# EasyEDA Pro project Class D amp.eprj, schematic DSP Adapter
Board Name: DSP Adapter; Create Date: 2026-05-17; Page Name: P1; Project Name: Class D amp; Schematic Name: DSP Adapter; Update Date: 2026-05-29; Company: EasyEDA.com; Page Size: A4; Version: V1.0
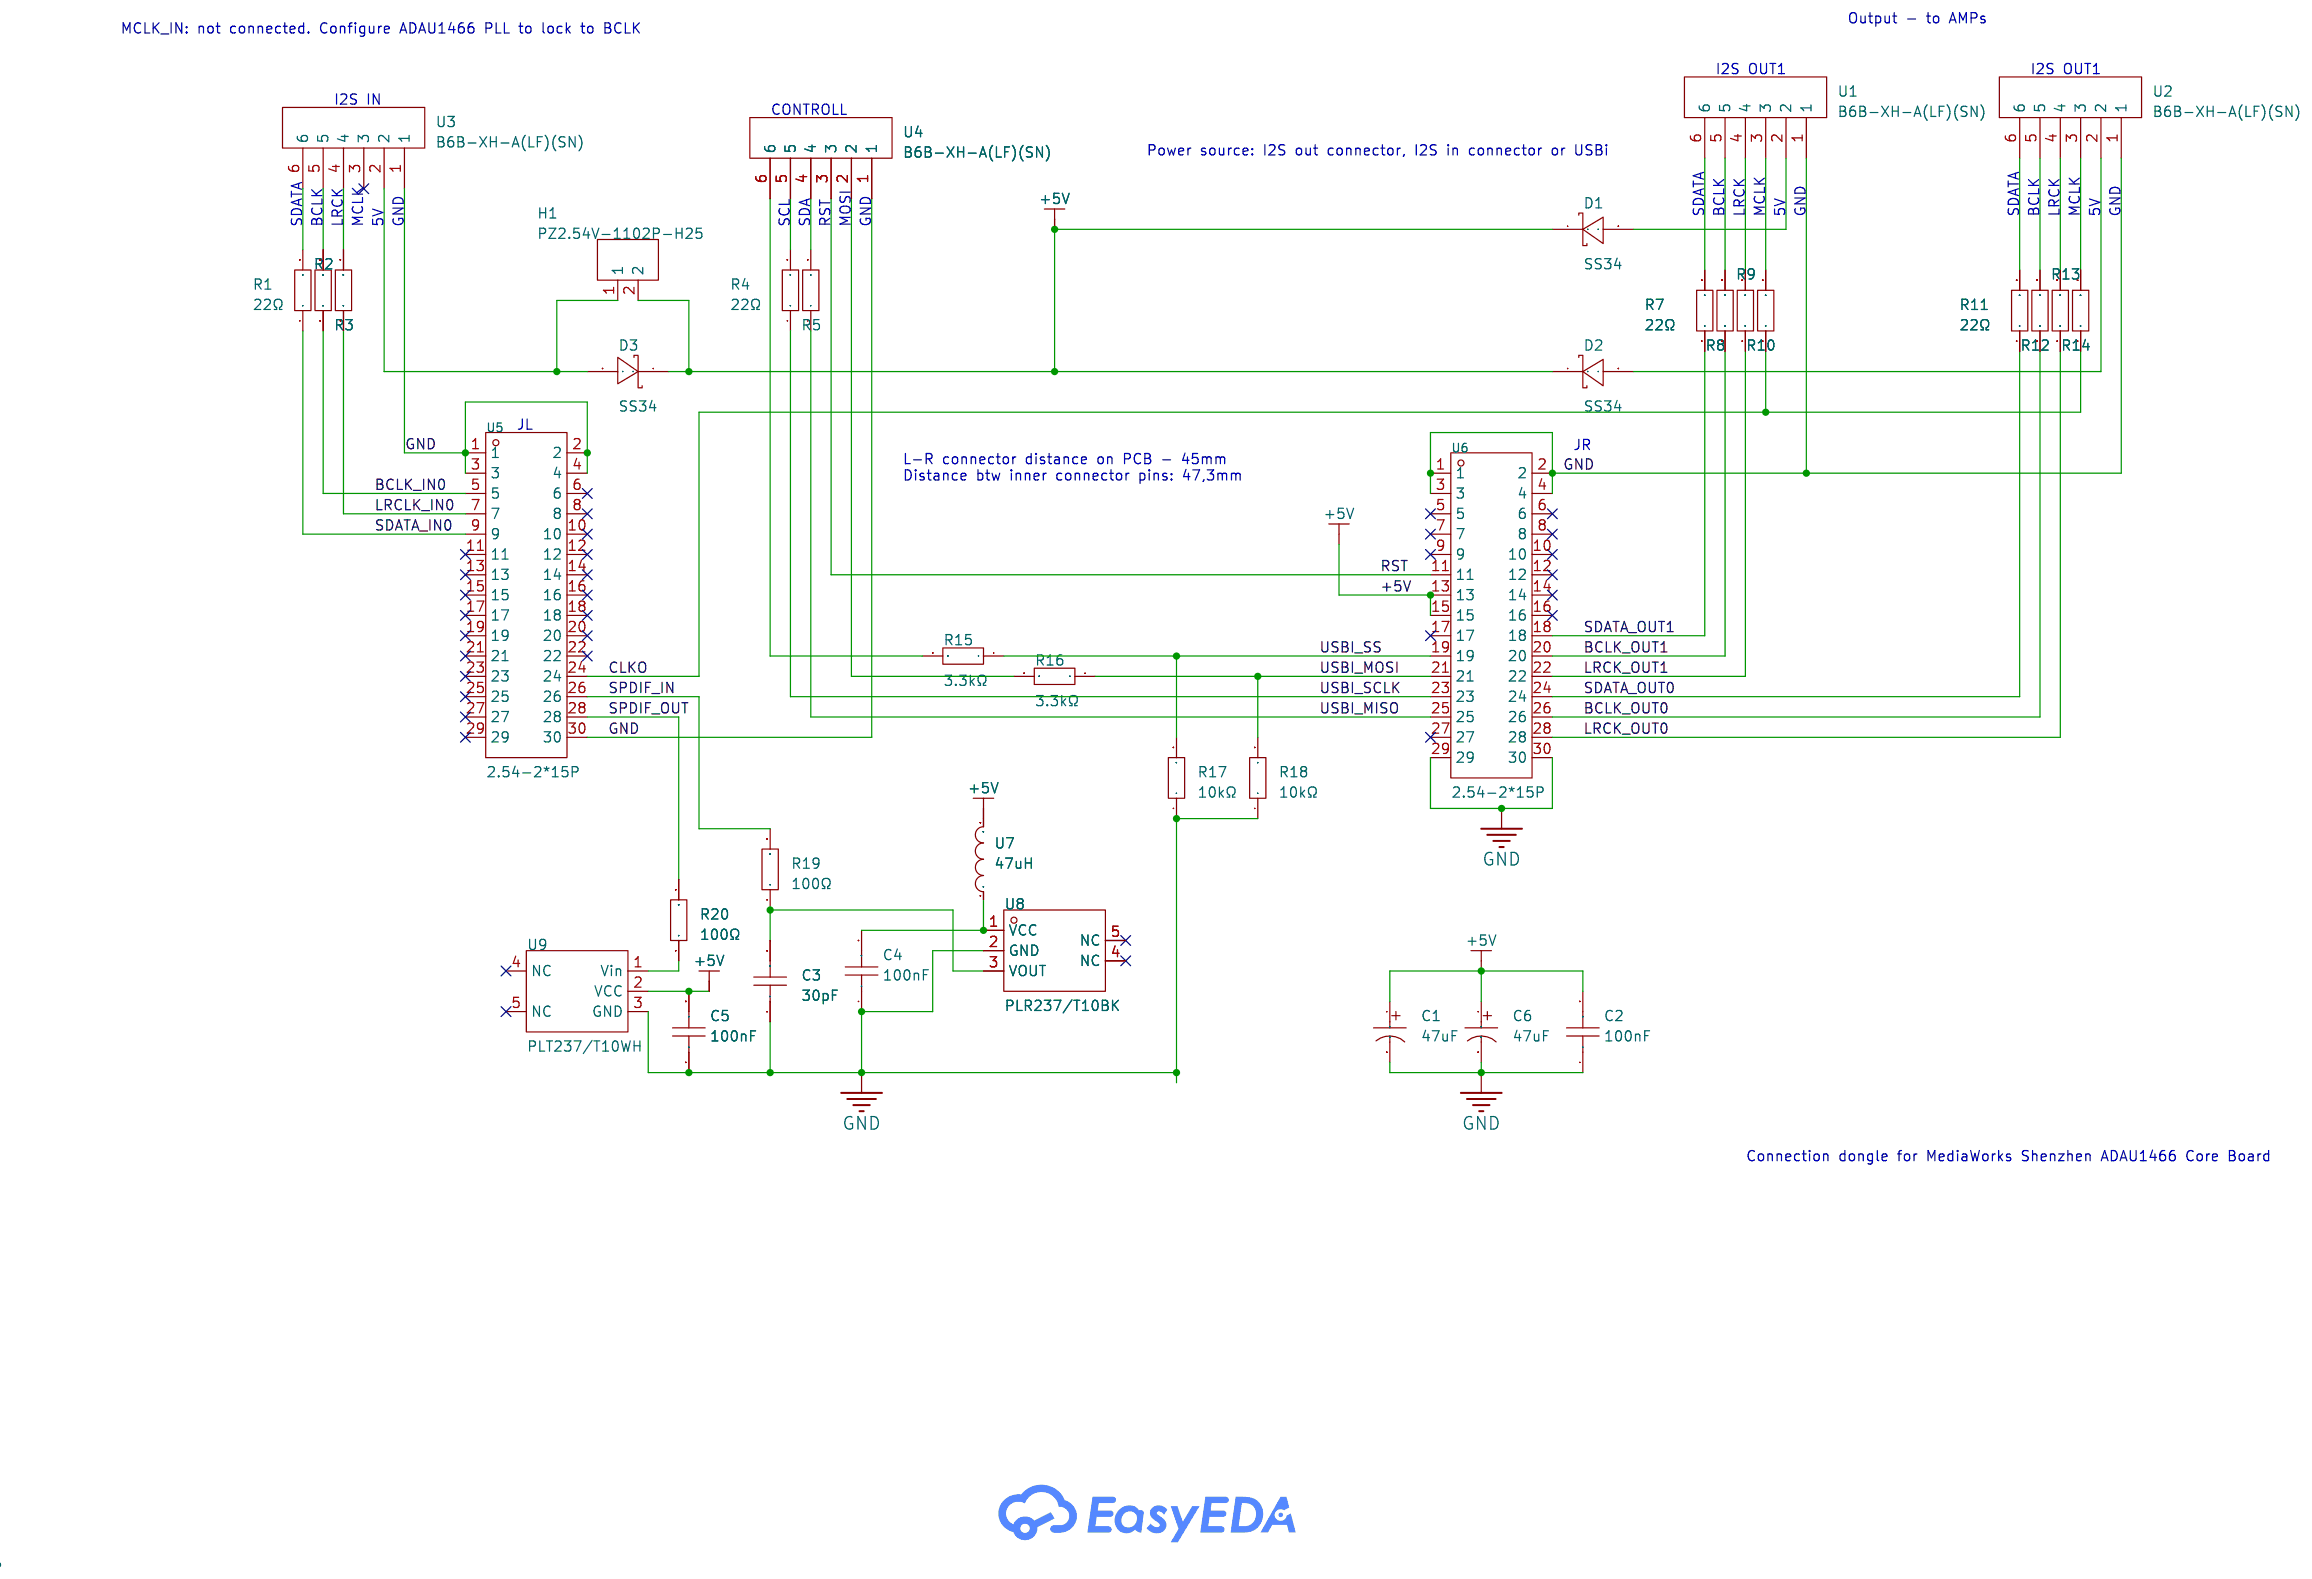
[diagram p5: schematic sheet]

## Parts
C1  47uF  [CAP-SMD_BD6.3-L6.6-W6.6-RD]
C2  100nF  [C0402]
C3  30pF  [C0805]
C4  100nF  [C0402]
C5  100nF  [C0402]
C6  47uF  [CAP-SMD_BD6.3-L6.6-W6.6-RD]
D1  SS34  [SMA_L4.3-W2.6-LS5.2-RD]
D2  SS34  [SMA_L4.3-W2.6-LS5.2-RD]
D3  SS34  [SMA_L4.3-W2.6-LS5.2-RD]
H1  PZ2.54V-1102P-H25  [HDR-TH_2P-P2.54-V-M-2]
R1  22Ω  [R0402]
R2  22Ω  [R0402]
R3  22Ω  [R0402]
R4  22Ω  [R0402]
R5  22Ω  [R0402]
R7  22Ω  [R0402]
R8  22Ω  [R0402]
R9  22Ω  [R0402]
R10  22Ω  [R0402]
R11  22Ω  [R0402]
R12  22Ω  [R0402]
R13  22Ω  [R0402]
R14  22Ω  [R0402]
R15  3.3kΩ  [R0402]
R16  3.3kΩ  [R0402]
R17  10kΩ  [R0603]
R18  10kΩ  [R0603]
R19  100Ω  [R0402]
R20  100Ω  [R0402]
U1  B6B-XH-A(LF)(SN)  [CONN-TH_6P-P2.50_B6B-XH-A-LF-SN]
U2  B6B-XH-A(LF)(SN)  [CONN-TH_6P-P2.50_B6B-XH-A-LF-SN]
U3  B6B-XH-A(LF)(SN)  [CONN-TH_6P-P2.50_B6B-XH-A-LF-SN]
U4  B6B-XH-A(LF)(SN)  [CONN-TH_6P-P2.50_B6B-XH-A-LF-SN]
U5  2.54-2*15P  [HDR-TH_30P-P2.54-V-F-R2-C15-S2.54]
U6  2.54-2*15P  [HDR-TH_30P-P2.54-V-F-R2-C15-S2.54]
U7  47uH  [IND-SMD_L4.5-W4.0]
U8  PLR237/T10BK  [OPTO-TH_PLR237-T10BK]
U9  PLT237/T10WH  [CONN-TH_PLT237-T10WH]

## Library data of the parts
C1 C6 = VES470M1HTR-0607: LCSC Part Name: 47uF ±20% 50V; Supplier Part: C108053; Manufacturer: Lelon(立隆); Supplier Footprint: SMD,D6.3xL7.7mm; JLCPCB Part Class: Extended Part; Datasheet: https://item.szlcsc.com/datasheet/VES470M1HTR-0607/109272.html; Supplier: LCSC; Tolerance: ±20%; Voltage Rating: 50V; Diameter: 6.3mm; Height - Seated (Max): 7.7mm; Lifetime: 1000hrs@105℃; Operating Temperature: -45℃~+105℃
C2 C4 C5 = CL05B104KO5NNNC: Capacitance:100nF Tolerance:±10% Tolerance:±10% Voltage Rating:16V Temperature Coefficient:X7R; LCSC Part Name: 100nF ±10% 16V; Supplier Part: C1525; Manufacturer: SAMSUNG(三星); Supplier Footprint: 0402; JLCPCB Part Class: Basic Part; Datasheet: https://item.szlcsc.com/datasheet/CL05B104KO5NNNC/1877.html; Supplier: LCSC; Tolerance: ±10%; Voltage Rating: 16V; Temperature Coefficient: X7R
C3 = HGC0805G0300J500NTGJ: LCSC Part Name: 30pF ±5% 50V; Supplier Part: C5186744; Manufacturer: Chinocera(华瓷); Supplier Footprint: 0805; JLCPCB Part Class: Extended Part; Datasheet: https://item.szlcsc.com/datasheet/HGC0805G0300J500NTGJ/5857753.html; Supplier: LCSC; Tolerance: ±5%; Voltage Rating: 50V; Temperature Coefficient: C0G
D1-D3 = SS34_C8678: LCSC Part Name: 电压:40V 电流:3A; Supplier Part: C8678; Manufacturer: MDD(辰达半导体); Supplier Footprint: SMA(DO-214AC); JLCPCB Part Class: Basic Part; Datasheet: https://item.szlcsc.com/datasheet/SS34/9178.html; Supplier: LCSC; Diode Configuration: Independent; Voltage - Forward(Vf@If): 550mV@3A; Voltage - DC Reverse(Vr): 40V; Current - Rectified: 3A; Reverse Leakage Current (Ir): 500uA@40V; Operating Junction Temperature Range: -55℃~+125℃
H1 = PZ2.54V-1102P-H25: LCSC Part Name: 1x2P 间距:2.54mm 方针 直插; Supplier Part: C42431681; Manufacturer: JXTCONN(聚兴泰); Supplier Footprint: 插件,P=2.54mm; JLCPCB Part Class: Extended Part; Datasheet: https://item.szlcsc.com/datasheet/PZ2.54V-1102P-H25/44458911.html; Supplier: LCSC; Pin Structure: 1x2P; Pitch: 2.54mm; Circluar Pins/Square Pins: Pin Header; Mounting Type: Through Hole; Number of Rows: 1; Number of Pins: 2P; Current Rating: 3A; Length of Mating Pin: 6mm; Insulation Height: 2.5mm; Length of End Connection Pin: 3mm; Contact Material: Brass; Contact Plating: Gold; Operating Temperature: -40℃~+105℃; Color: Black
R1-R5 R7-R14 = RC0402FR-0722RL: LCSC Part Name: 厚膜电阻 22Ω ±1% 62.5mW; Supplier Part: C114765; Manufacturer: YAGEO(国巨); Supplier Footprint: 0402; JLCPCB Part Class: Extended Part; Datasheet: https://atta.szlcsc.com/upload/public/pdf/source/20180821/C275644_0D56F95EFF785E7D9A1FEF436B37DA78.pdf; Supplier: LCSC; Type: Thick Film Resistors; Tolerance: ±1%; Temperature Coefficient: ±100ppm/℃; Operating Temperature Range: -55℃~+155℃
R15 R16 = FRC0402F3301TS: Type:Thick Film Resistor Resistance:3.3kΩ Tolerance:±1% Tolerance:±1% Power(Watts):62.5mW Voltage-Supply(Max):50V Temperature Coefficient:±100ppm/℃ Temperature Coefficient:±100ppm/℃ Operating Temperature:-55℃~+155℃ Operating Temperature:-55℃~+155℃; LCSC Part Name: 3.3kΩ ±1% 62.5mW 厚膜电阻; Supplier Part: C2909345; Manufacturer: FOJAN(富捷); Supplier Footprint: 0402; JLCPCB Part Class: Extended Part; Supplier: LCSC; Type: Thick Film Resistor; Tolerance: ±1%; Power(Watts): 62.5mW; Voltage-Supply(Max): 50V; Temperature Coefficient: ±100ppm/℃; Operating Temperature: -55℃~+155℃
R17 R18 = 0603WAF1002T5E: Type:Thick Film Resistor Resistance:10kΩ Tolerance:±1% Tolerance:±1% Power(Watts):100mW Voltage-Supply(Max):75V Temperature Coefficient:±100ppm/℃ Temperature Coefficient:±100ppm/℃ Operating Temperature:-55℃~+155℃ Operating Temperature:-55℃~+155℃; LCSC Part Name: 厚膜电阻 10kΩ ±1% 100mW; Supplier Part: C25804; Manufacturer: UNI-ROYAL(厚声); Supplier Footprint: 0603; JLCPCB Part Class: Basic Part; Datasheet: https://item.szlcsc.com/datasheet/0603WAF1002T5E/26547.html; Supplier: LCSC; Type: Thick Film Resistor; Tolerance: ±1%; Power(Watts): 100mW; Voltage-Supply(Max): 75V; Temperature Coefficient: ±100ppm/℃; Operating Temperature: -55℃~+155℃
R19 R20 = RC0402FR-07100RL: Type:Thick Film Resistor Resistance:100Ω Tolerance:±1% Tolerance:±1% Power(Watts):62.5mW Voltage-Supply(Max):50V Temperature Coefficient:±100ppm/℃ Temperature Coefficient:±100ppm/℃ Operating Temperature:-55℃~+155℃ Operating Temperature:-55℃~+155℃; LCSC Part Name: 厚膜电阻 100Ω ±1% 62.5mW; Supplier Part: C106232; Manufacturer: YAGEO(国巨); Supplier Footprint: 0402; JLCPCB Part Class: Extended Part; Datasheet: https://item.szlcsc.com/datasheet/RC0402FR-07100RL/107447.html; Supplier: LCSC; Type: Thick Film Resistor; Tolerance: ±1%; Power(Watts): 62.5mW; Voltage-Supply(Max): 50V; Temperature Coefficient: ±100ppm/℃; Operating Temperature: -55℃~+155℃
U1-U4 = B6B-XH-A(LF)(SN): LCSC Part Name: 1x6P 间距:2.5mm 直插 系列:XH; Supplier Part: C144397; Manufacturer: JST; Supplier Footprint: 插件,P=2.5mm; JLCPCB Part Class: Extended Part; Datasheet: https://item.szlcsc.com/datasheet/B6B-XH-A(LF)(SN)/155729.html; Supplier: LCSC; Pins Structure: 1x6P; Pitch: 2.5mm; Mounting Type: Through Hole; Reference Series: XH; Number of Pins: 6P; Number of Rows: 1; Number of PINs Per Row: 6; Current Rating: 3A; Contact Material: Brass; Contact Plating: Tin; Operating Temperature: -25℃~+85℃; Voltage Rating: 250V; Plastic Material: PA66; Flame Retardant Rating: UL94V-0; Supplementary Features: K Pin; Color: White; Z-Height of the Board: 7mm; X-Length of Bottom Edge on Board (Spacing Line): 17.4mm; Y-Width of Bottom Edge on Board: 5.75mm
U5 U6 = 2.54-2*15P: LCSC Part Name: 2x15P 间距:2.54mm 直插; Supplier Part: C5337168; Manufacturer: BOOMELE(博穆精密); Supplier Footprint: 插件,P=2.54mm; JLCPCB Part Class: Extended Part; Datasheet: https://item.szlcsc.com/datasheet/2.54-2*15P/6103316.html; Supplier: LCSC; Holes Structure: 2x15P; Pitch: 2.54mm; Row Spacing: 2.54mm; Circular Hole / Square Hole: Square Hole; Mounting Type: Through Hole; Number of Rows: 2; Number of Positions: 30P; Current Rating: 2.5A; Holes Direction: Top; Insulation Height: 8.5mm; Contact Material: Brass; Contact Plating: Gold; Operating Temperature: -55℃~+105℃; PIN Length: 3.1mm
U7 = CY43-47UH: Inductance:47uH Tolerance:±10% Tolerance:±10% Current Rating:500mA Current - Saturation (Isat):- DC Resistance(DCR):820mΩ Q @ Frequency:- Frequency - Self Resonant:- Ratings:- Type:-; LCSC Part Name: 47uH ±10%; Supplier Part: C2929422; Manufacturer: SHOU HAN(首韩); Supplier Footprint: SMD,4.5x4mm; JLCPCB Part Class: Extended Part; Datasheet: https://item.szlcsc.com/datasheet/CY43-47UH/3264904.html; Supplier: LCSC; Tolerance: ±10%; Current Rating: 500mA; DC Resistance(DCR): 820mΩ
U8 = PLR237/T10BK: Supplier Part: C17427482; Manufacturer: EVERLIGHT(亿光); Supplier Footprint: 插件,13.5x9.7mm; JLCPCB Part Class: Extended Part; Datasheet: https://www.everlighteurope.com/custom/files/datasheets/DPL-0000261.pdf; Supplier: LCSC; Type: Fiber Optic Receiver; Wavelength: 650nm
U9 = PLT237/T10WH: Supplier Part: C17296340; Manufacturer: EVERLIGHT(亿光); JLCPCB Part Class: Extended Part; Supplier: LCSC; Type: Fiber Optic Transmitter

## Nets
+5V: C1.1 C2.2 C5.2 C6.1 D1.1(K) D2.1(K) D3.1(K) H1.2 U6.13 U6.15 U7.2 U9.2(VCC)
GND: C1.2 C2.1 C3.1 C4.1 C5.1 C6.2 R17.1 R18.1 U1.1 U2.1 U3.1 U4.1 U5.1 U5.2 U5.3 U5.4 U5.30 U6.1 U6.2 U6.3 U6.4 U6.29 U6.30 U8.2(GND) U9.3(GND)
BCLK_IN0: R2.1 U5.5
BCLK_OUT0: R12.1 U6.26
BCLK_OUT1: R8.1 U6.20
CLKO: R10.1 R14.1 U5.24
LRCK_OUT0: R13.1 U6.28
LRCK_OUT1: R9.1 U6.22
LRCLK_IN0: R3.1 U5.7
RST: U4.3 U6.11
SDATA_IN0: R1.1 U5.9
SDATA_OUT0: R11.1 U6.24
SDATA_OUT1: R7.1 U6.18
SPDIF_IN: R19.2 U5.26
SPDIF_OUT: R20.2 U5.28
USBI_MISO: R5.1 U6.25
USBI_MOSI: R16.1 R18.2 U6.21
USBI_SCLK: R4.1 U6.23
USBI_SS: R15.1 R17.2 U6.19
$1N2334: R1.2 U3.6
$1N2378: R2.2 U3.5
$1N2459: R3.2 U3.4
$1N2540: R4.2 U4.5
$1N2584: R5.2 U4.4
$1N2632: R7.2 U1.6
$1N2672: R8.2 U1.5
$1N2720: R9.2 U1.4
$1N2760: R10.2 U1.3
$1N2808: R11.2 U2.6
$1N2926: R14.2 U2.3
$1N2937: R13.2 U2.4
$1N2944: R12.2 U2.5
$1N3358: C4.2 U7.1 U8.1(VCC)
$1N3377: C3.2 R19.1 U8.3(VOUT)
$1N3409: R20.1 U9.1(Vin)
$1N6189: R15.2 U4.6
$1N6196: R16.2 U4.2
$1N8376: D3.2(A) H1.1 U3.2
$1N9564: D1.2(A) U1.2
$1N9604: D2.2(A) U2.2

Not connected (* = marked no-connect by the designer): U3 3*; U5 6* 8* 10* 11* 12* 13* 14* 15* 16* 17* 18* 19* 20* 21* 22* 23* 25* 27* 29*; U6 5* 6* 7* 8* 9* 10* 12* 14* 16* 17* 27*; U8 4(NC)* 5(NC)*; U9 4(NC)* 5(NC)*

## Notes on the sheet
- Output - to AMPs
- MCLK_IN: not connected. Configure ADAU1466 PLL to lock to BCLK
- I2S OUT1
- I2S OUT1
- I2S IN
- CONTROLL
- Power source: I2S out connector, I2S in connector or USBi
- SDATA
- BCLK
- LRCK
- MCLK
- 5V
- GND
- SDATA
- BCLK
- LRCK
- MCLK
- 5V
- GND
- SDATA
- BCLK
- LRCK
- MCLK
- 5V
- GND
- SCL
- SDA
- RST
- MOSI
- GND
- JL
- JR
- L-R connector distance on PCB - 45mm
  Distance btw inner connector pins: 47,3mm
- Connection dongle for MediaWorks Shenzhen ADAU1466 Core Board
